# EAGLE design debounce_v0.1 (EAGLE 9.6.2)
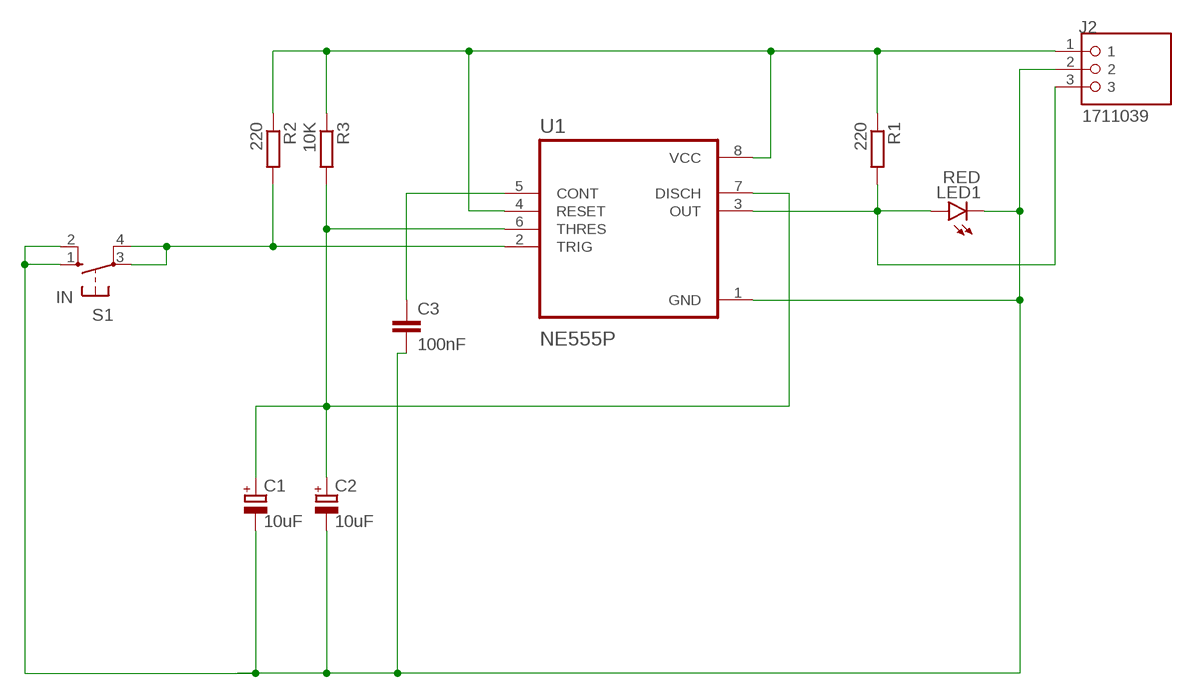
[diagram p0: schematic, sheet 1]

## Parts
C1  10uF  CPOL-EUE2.5-6  [E2,5-6]
C2  10uF  CPOL-EUE2.5-6  [E2,5-6]
C3  100nF  RCL_C-EU025-025X050  [RCL_C025-025X050]
J2  1711039  [PHOENIX_1711039]
LED1  RED  LED3MM  [LED3MM]
R1  220  RCL_R-EU_0207/7  [RCL_0207/7]
R2  220  RCL_R-EU_0207/7  [RCL_0207/7]
R3  10K  RCL_R-EU_0207/7  [RCL_0207/7]
S1  IN  10-XX  [B3F-10XX]
U1  NE555P  [DIP794W45P254L959H508Q8]

## Nets
CONT: C3.1 U1.5(CONT)
DISCH/THRES: C1.+ C2.+ R3.2 U1.6(THRES) U1.7(DISCH)
GND [ground]: C1.- C2.- C3.2 J2.2 LED1.K(C) S1.1(S) S1.2(S1) U1.1(GND)
OUT: J2.3 LED1.A R1.2 U1.3(OUT)
TRIG: R2.2 S1.3(P) S1.4(P1) U1.2(TRIG)
VCC [vcc]: J2.1 R1.1 R2.1 R3.1 U1.4(RESET) U1.8(VCC)

## Library data of the parts
C1 C2 = rcl:CPOL-EU: POLARIZED CAPACITOR, European symbol; SPICEPREFIX: C
C3 = v0.4:RCL_C-EU: CAPACITOR, European symbol; SPICEPREFIX: C
J2 = 1711039:1711039: Check availability <https://pricing.snapeda.com/parts/1711039/Phoenix%20Contact/view-part?ref=eda>; AVAILABILITY: In Stock; CHECK_PRICES: https://www.snapeda.com/parts/1711039/Phoenix+Contact/view-part/?ref=eda; DESCRIPTION: PCB Terminal Screw 5mm 12AWG 400V 24A 3 Position COMBICON MKDS Series | Phoenix Contact 1711039; MF: Phoenix Contact; MP: 1711039; PACKAGE: None; PRICE: None; SNAPEDA_LINK: https://www.snapeda.com/parts/1711039/Phoenix+Contact/view-part/?ref=snap
LED1 = led:LED: LED OSRAM: - CHIPLED LG R971, LG N971, LY N971, LG Q971, LY Q971, LO R971, LY R971 LH N974, LH R974 LS Q976, LO Q976, LY Q976 LO Q996 - Hyper CHIPLED LW Q18S LB Q993, LB Q99A, LB R99A - SideLED LS A670, LO A670, LY A670, LG A670, LP A670 LB A673, LV A673, LT A673, LW A673 LH A674 LY A675 LS A676, LA A676, LO A676, LY A676, LW A676 LS A679, LY A679, LG A679 - Hyper Micro SIDELED® LS Y876, LA Y876, LO Y876, LY Y876 LT Y87S - SmartLED LW L88C, LW L88S LB L89C, LB L89S, LG L890 LS L89K, LO L89K, LY L89K LS L896, LA L896, LO L896, LY L896 - TOPLED LS T670, LO T670, LY T670, LG T670, LP T670 LSG T670, LSP T670, LSY T670, LOP T670, LYG T670 LG T671, LOG T671, LSG T671 LB T673, LV T673, LT T673, LW T673 LH T674 LS T676, LA T676, LO T676, LY T676, LB T676, LH T676, LSB T676, LW T676 LB T67C, LV T67C, LT T67C, LS T67K, LO T67K, LY T67K, LW E67C LS E67B, LA E67B, LO E67B, LY E67B, LB E67C, LV E67C, LT E67C LW T67C LS T679, LY T679, LG T679 LS T770, LO T770, LY T770, LG T770, LP T770 LB T773, LV T773, LT T773, LW T773 LH T774 LS E675, LA E675, LY E675, LS T675 LS T776, LA T776, LO T776, LY T776, LB T776 LHGB T686 LT T68C, LB T68C - Hyper Mini TOPLED® LB M676 - Mini TOPLED Santana® LG M470 LS M47K, LO M47K, LY M47K Source: http://www.osram.convergy.de LUXEON: - LUMILED® LXK2-PW12-R00, LXK2-PW12-S00, LXK2-PW14-U00, LXK2-PW14-V00 LXK2-PM12-R00, LXK2-PM12-S00, LXK2-PM14-U00 LXK2-PE12-Q00, LXK2-PE12-R00, LXK2-PE12-S00, LXK2-PE14-T00, LXK2-PE14-U00 LXK2-PB12-K00, LXK2-PB12-L00, LXK2-PB12-M00, LXK2-PB14-N00, LXK2-PB14-P00, LXK2-PB14-Q00 LXK2-PR12-L00, LXK2-PR12-M00, LXK2-PR14-Q00, LXK2-PR14-R00 LXK2-PD12-Q00, LXK2-PD12-R00, LXK2-PD12-S00 LXK2-PH12-R00, LXK2-PH12-S00 LXK2-PL12-P00, LXK2-PL12-Q00, LXK2-PL12-R00 Source: www.luxeon.com KINGBRIGHT: KA-3528ASYC Source: www.kingbright.com
R1-R3 = v0.4:RCL_R-EU_: RESISTOR, European symbol; SPICEPREFIX: R
S1 = switch-omron:10-XX: OMRON SWITCH; MPN: B3F-1000; OC_FARNELL: 176432; OC_NEWARK: 36M3542
U1 = NE555P:NE555P: Check availability <https://pricing.snapeda.com/parts/NE555P/Texas%20Instruments/view-part?ref=eda>; AVAILABILITY: In Stock; CHECK_PRICES: https://www.snapeda.com/parts/NE555P/Texas+Instruments/view-part/?ref=eda; DESCRIPTION: Single Precision Timer; MF: Texas Instruments; MP: NE555P; PACKAGE: PDIP-8 Texas; PRICE: None; SNAPEDA_LINK: https://www.snapeda.com/parts/NE555P/Texas+Instruments/view-part/?ref=snap

## Net classes
0 default: width 0.635 mm
1 vcc: width 1.27 mm
2 ground: width 1.27 mm

## Board
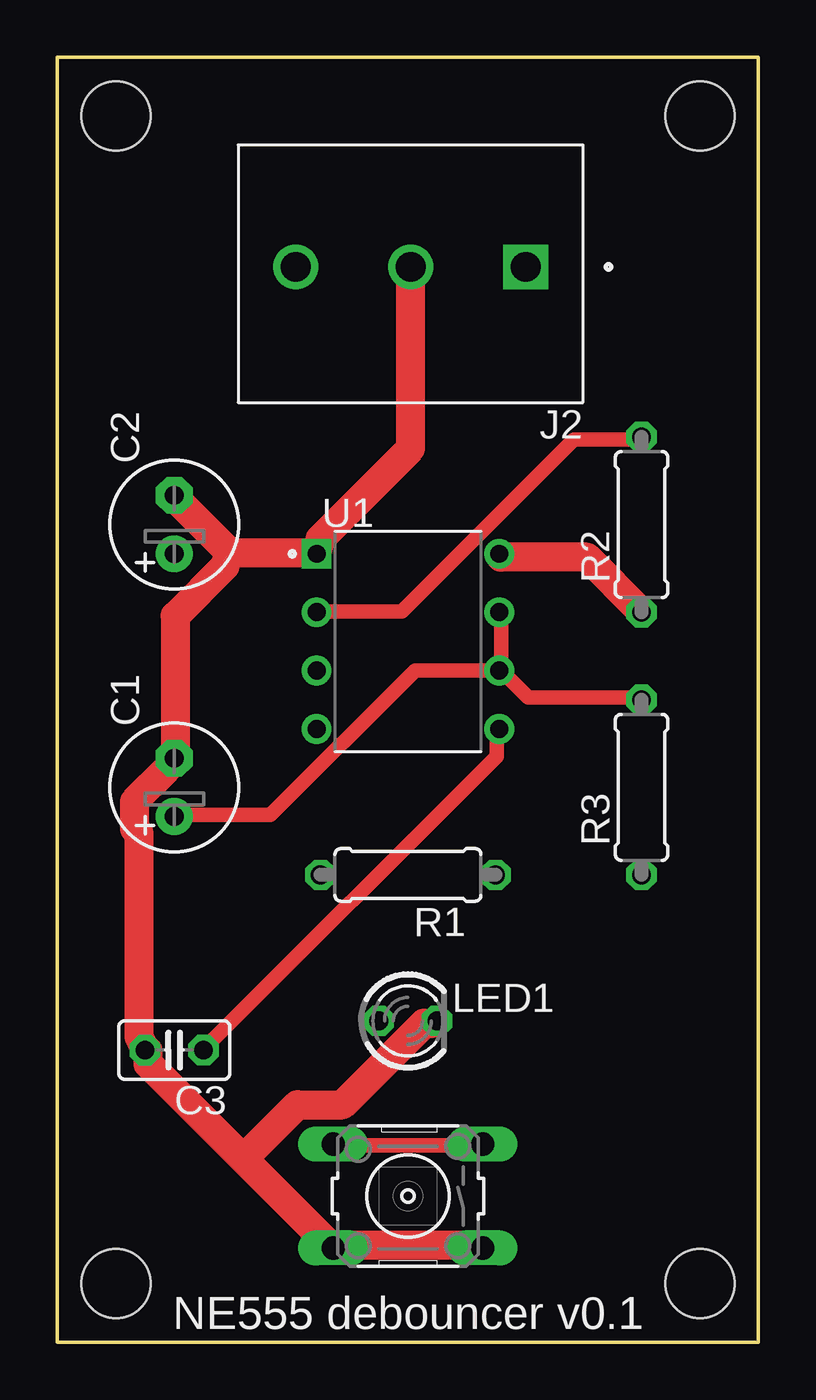
[diagram p1: board, top side]
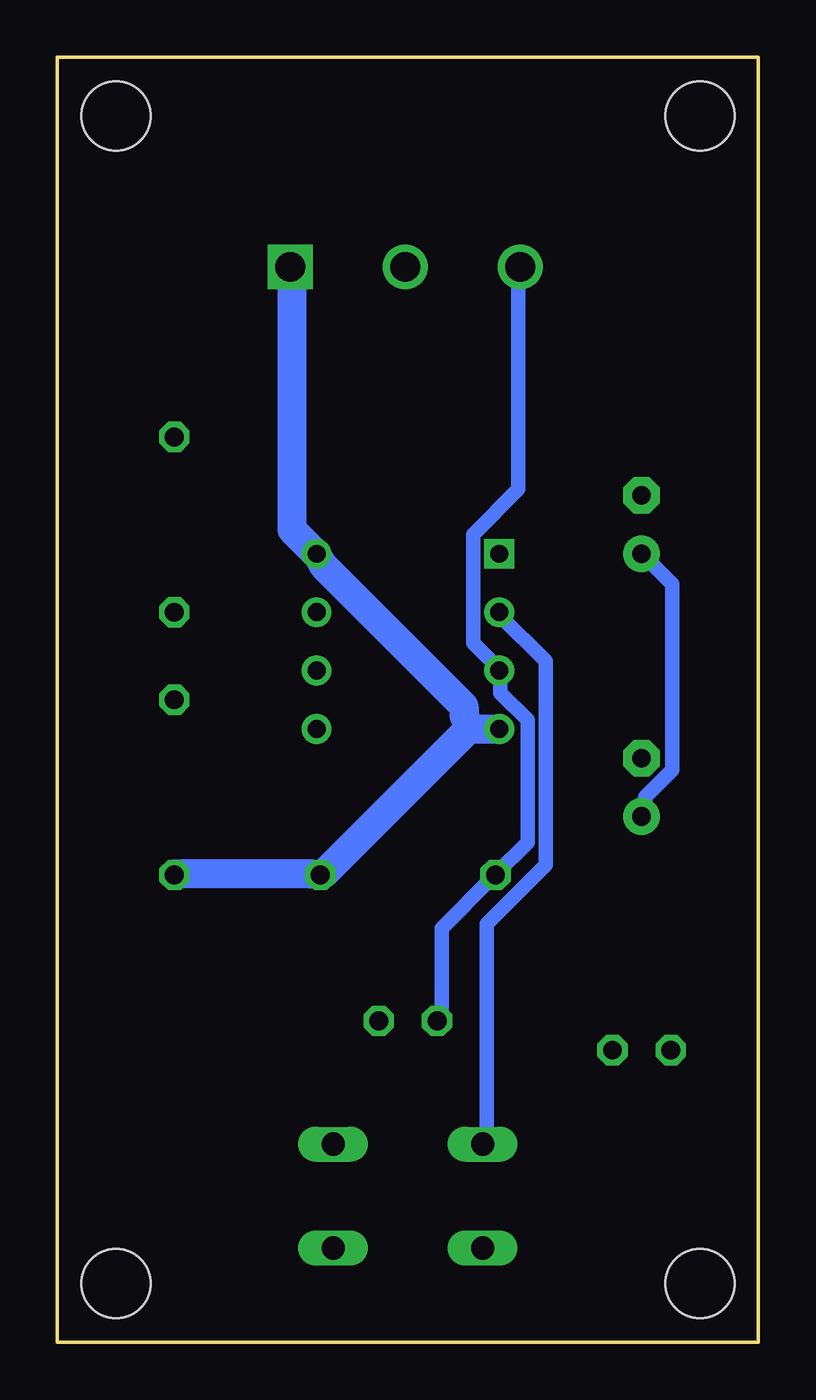
[diagram p2: board, bottom side, seen from below]

Size 30.48 x 55.88 mm. Coordinates in mm from the lower left corner, seen from the top.
Outline: 0,0 0,55.88 30.48,55.88 30.48,0 0,0
Copper layers (1*16): Top 0.035mm / dielectric 1.5mm / Bottom 0.035mm
Design rules "default": minimum track width 6mil, minimum drill 0.35mm, track to track 6mil, track to pad 6mil, pad to pad 6mil, via to via 6mil, smd to smd 6mil, copper to edge 40mil, drill to drill 6mil, minimum pad ring 10mil, minimum via ring 8mil, stop-mask expansion 4mil, vias tented up to drill 0mil, thermal gap 10mil
Holes 3 mm at 2.54,2.54 27.94,2.54 27.94,53.34 2.54,53.34

### Footprints (pad centres in the part's own frame; a part is rotated, then mirrored left to right if it is on the bottom)
E2,5-6 = drill 0.813 pad 1.6: + -1.27,0 | drill 0.813 pad 1.6 octagon: - 1.27,0
RCL_C025-025X050 = drill 0.813 octagon: 1 -1.27,0; 2 1.27,0
PHOENIX_1711039 = drill 1.3 square: 1 2.5,5.3 | drill 1.3: 2 7.5,5.3; 3 12.5,5.3
LED3MM = drill 0.813 octagon: A -1.27,0; K 1.27,0
RCL_0207/7 = drill 0.813 octagon: 1 -3.81,0; 2 3.81,0
B3F-10XX = drill 1.016 long: 1 -3.251,2.261; 2 3.251,2.261; 3 -3.251,-2.261; 4 3.251,-2.261
DIP794W45P254L959H508Q8 = drill 0.78 pad 1.13 square: 1 -3.97,3.81 | drill 0.78 pad 1.13: 2 -3.97,1.27; 3 -3.97,-1.27; 4 -3.97,-3.81; 5 3.97,-3.81; 6 3.97,-1.27; 7 3.97,1.27; 8 3.97,3.81

### Placement (x,y rotation side)
C1  5.08,24.13 90 top
C2  5.08,35.56 90 top
C3  5.08,12.7 180 top
J2  22.86,52.07 180 top
LED1  15.24,13.97 0 top
R1  15.24,20.32 180 top
R2  25.4,35.56 90 top
R3  25.4,24.13 90 top
S1  15.24,6.35 180 top
U1  15.24,30.48 0 top

### Tracks (layer width: path | path; a pad name or v marks a point on that pad's centre or on a via)
CONT
  Top 0.635: U1.5 19.09,26.66 19.09,25.48 6.5,12.88 C3.1
DISCH/THRES
  Top 0.635: U1.6 19.29,29.22 19.29,31.59 U1.7 | R3.2 25.39,28.04 20.47,28.04 19.49,29.03 U1.6 | U1.6 18.9,29.22 15.55,29.22 9.25,22.92 5.12,22.92 C1.+
  Bottom 0.635: C1.+ 4.92,22.92 4.92,23.71 3.74,24.89 3.74,32.96 4.92,34.14 C2.+
GND
  Top 1.27: 8.07,7.96 11.81,4.22 S1.2 12.6,4.22 18.31,4.22 S1.1 | 8.07,7.96 3.94,12.1 3.94,12.69 C3.2 3.54,13.28 3.54,22.14 3.35,22.33 3.35,23.51 4.72,24.89 C1.- 5.12,25.48 5.12,31.59 7.28,33.75 7.48,34.34 | 8.07,7.96 10.43,10.32 12.4,10.32 15.95,13.87 16.34,13.87 LED1.K | 7.48,34.34 11.22,34.34 U1.1 11.42,34.93 15.35,38.87 15.35,46.74 J2.2 | 7.48,34.34 5.12,36.7 C2.-
OUT
  Bottom 0.635: LED1.A 13.78,14.06 13.78,18 11.61,20.17 R1.2 11.42,20.36 10.04,21.74 10.04,27.06 11.22,28.24 11.22,29.03 U1.3 11.42,29.42 12.4,30.4 12.4,35.13 10.43,37.1 10.43,46.74 J2.3
TRIG
  Top 0.635: S1.4 12.01,8.55 18.31,8.55 S1.3 | U1.2 11.42,31.78 14.96,31.78 22.44,39.26 25.39,39.26 R2.2
  Bottom 0.635: S1.4 11.81,8.75 11.81,18.2 9.25,20.76 9.25,29.62 11.22,31.59 U1.2
VCC
  Top 1.27: U1.8 19.29,34.14 23.03,34.14 25.39,31.78 R2.1
  Bottom 1.27: 12.6,26.66 11.42,26.66 U1.4 | 12.6,26.66 18.9,20.36 R1.1 19.49,20.36 25.39,20.36 R3.1 | J2.1 20.28,46.74 20.28,35.33 19.29,34.34 U1.8 18.9,33.75 12.79,27.65 12.79,27.25 12.6,26.66

### Text on the board
tPlace: NE555 debouncer v0.1